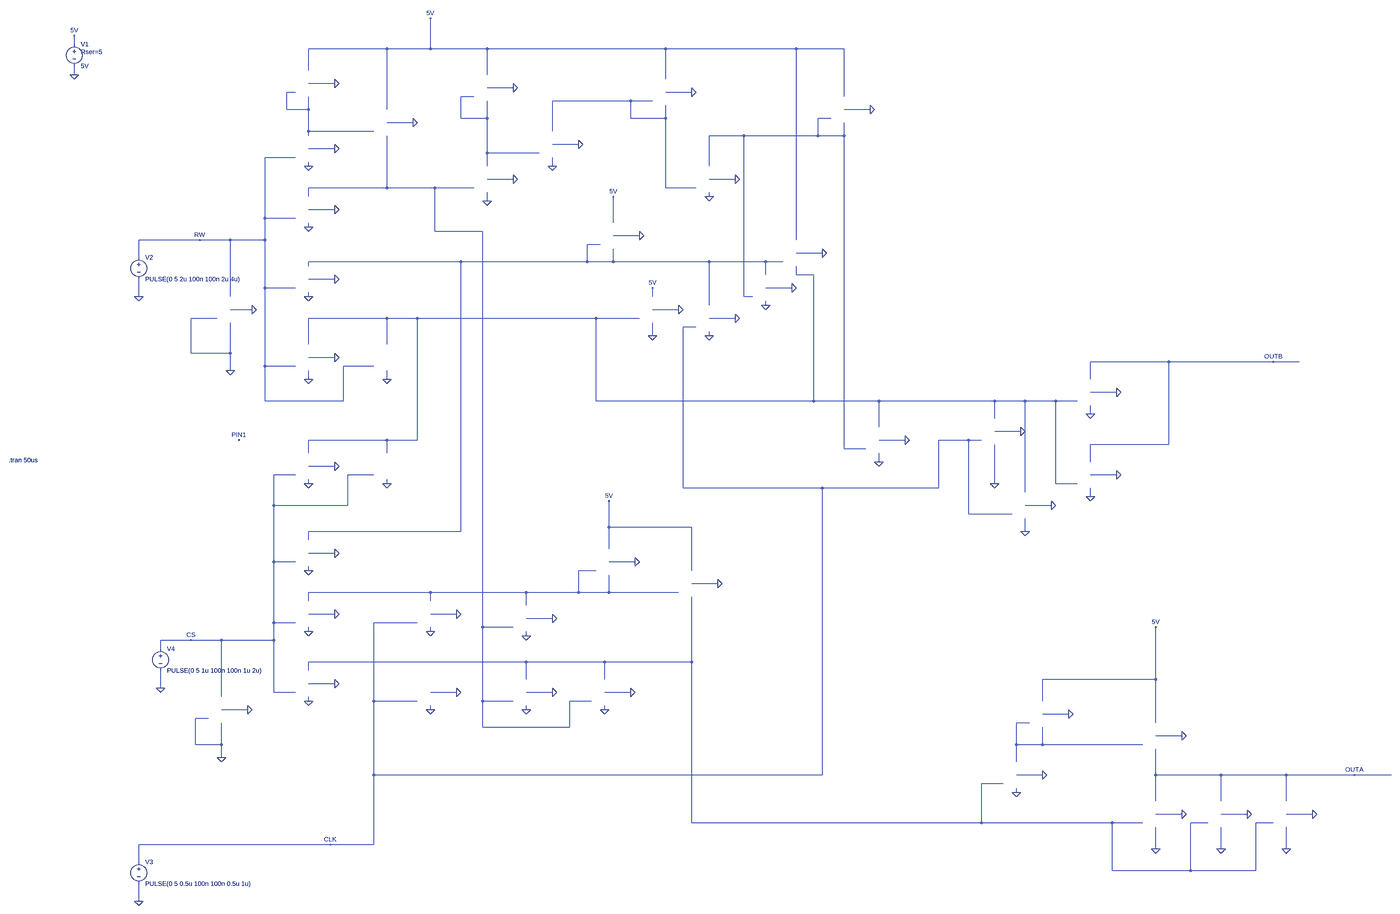
[diagram p0: schematic CSRW.asc, whole sheet]
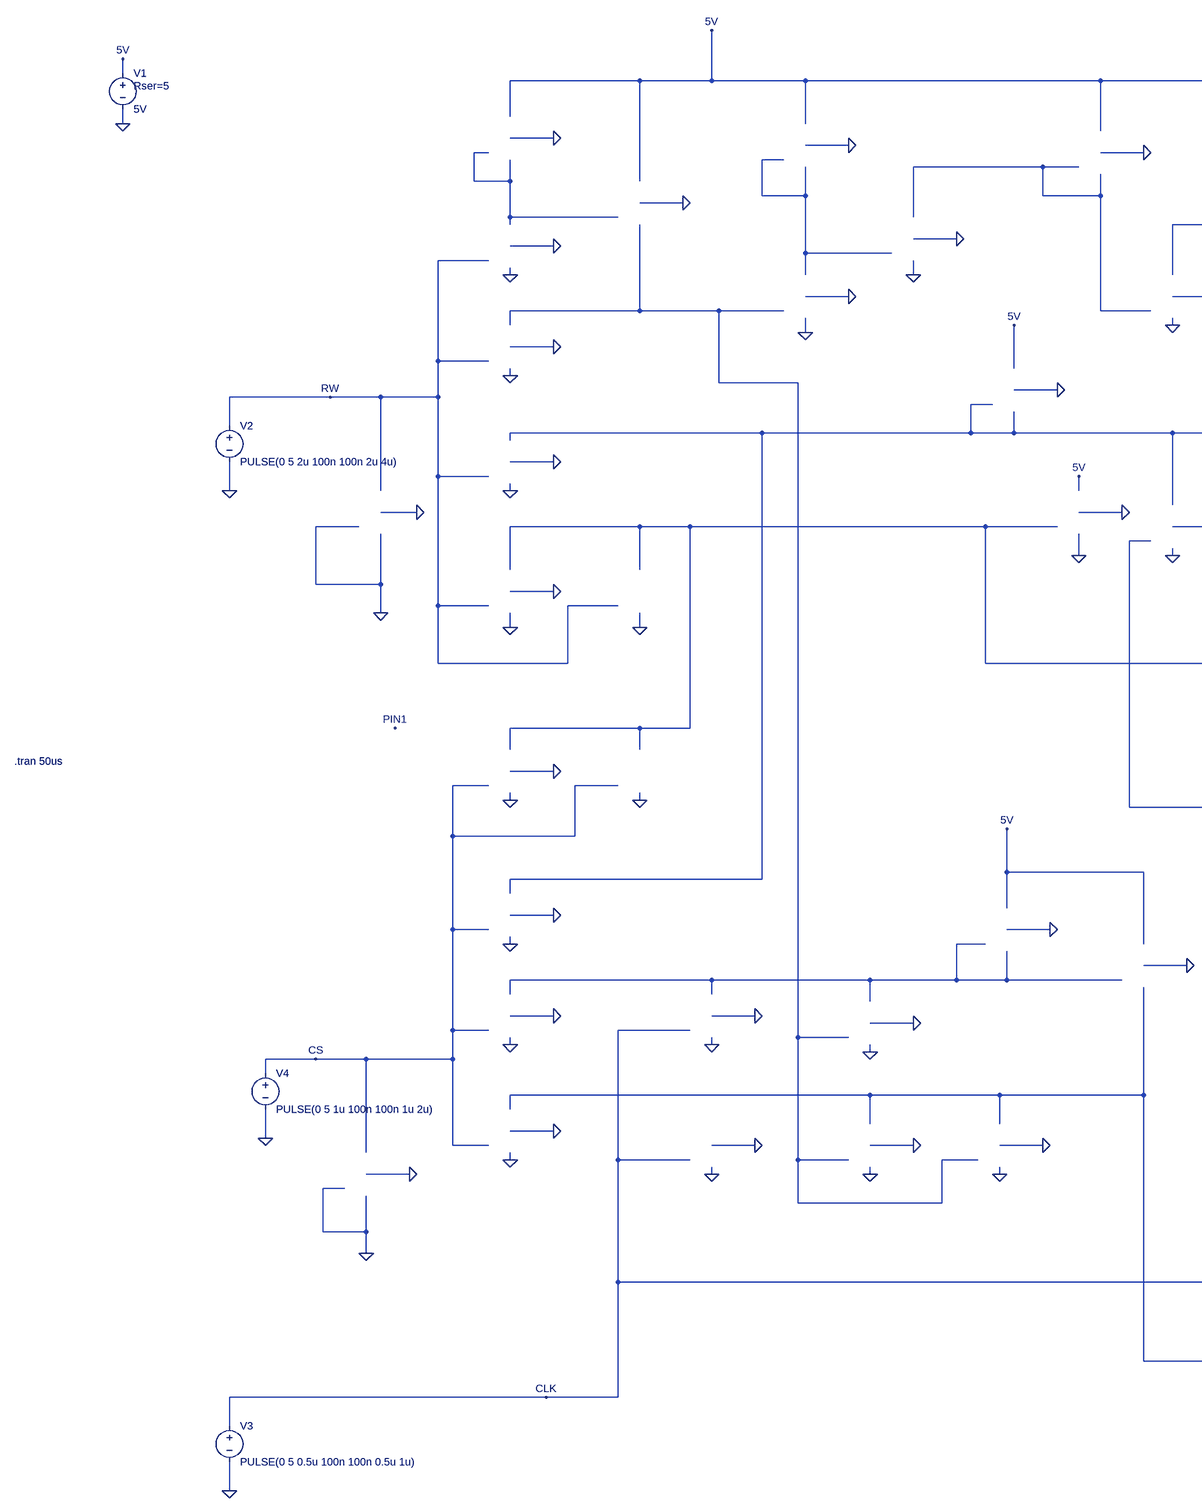
[diagram p1: schematic CSRW.asc, part, row 1 of 1, column 1 of 2]
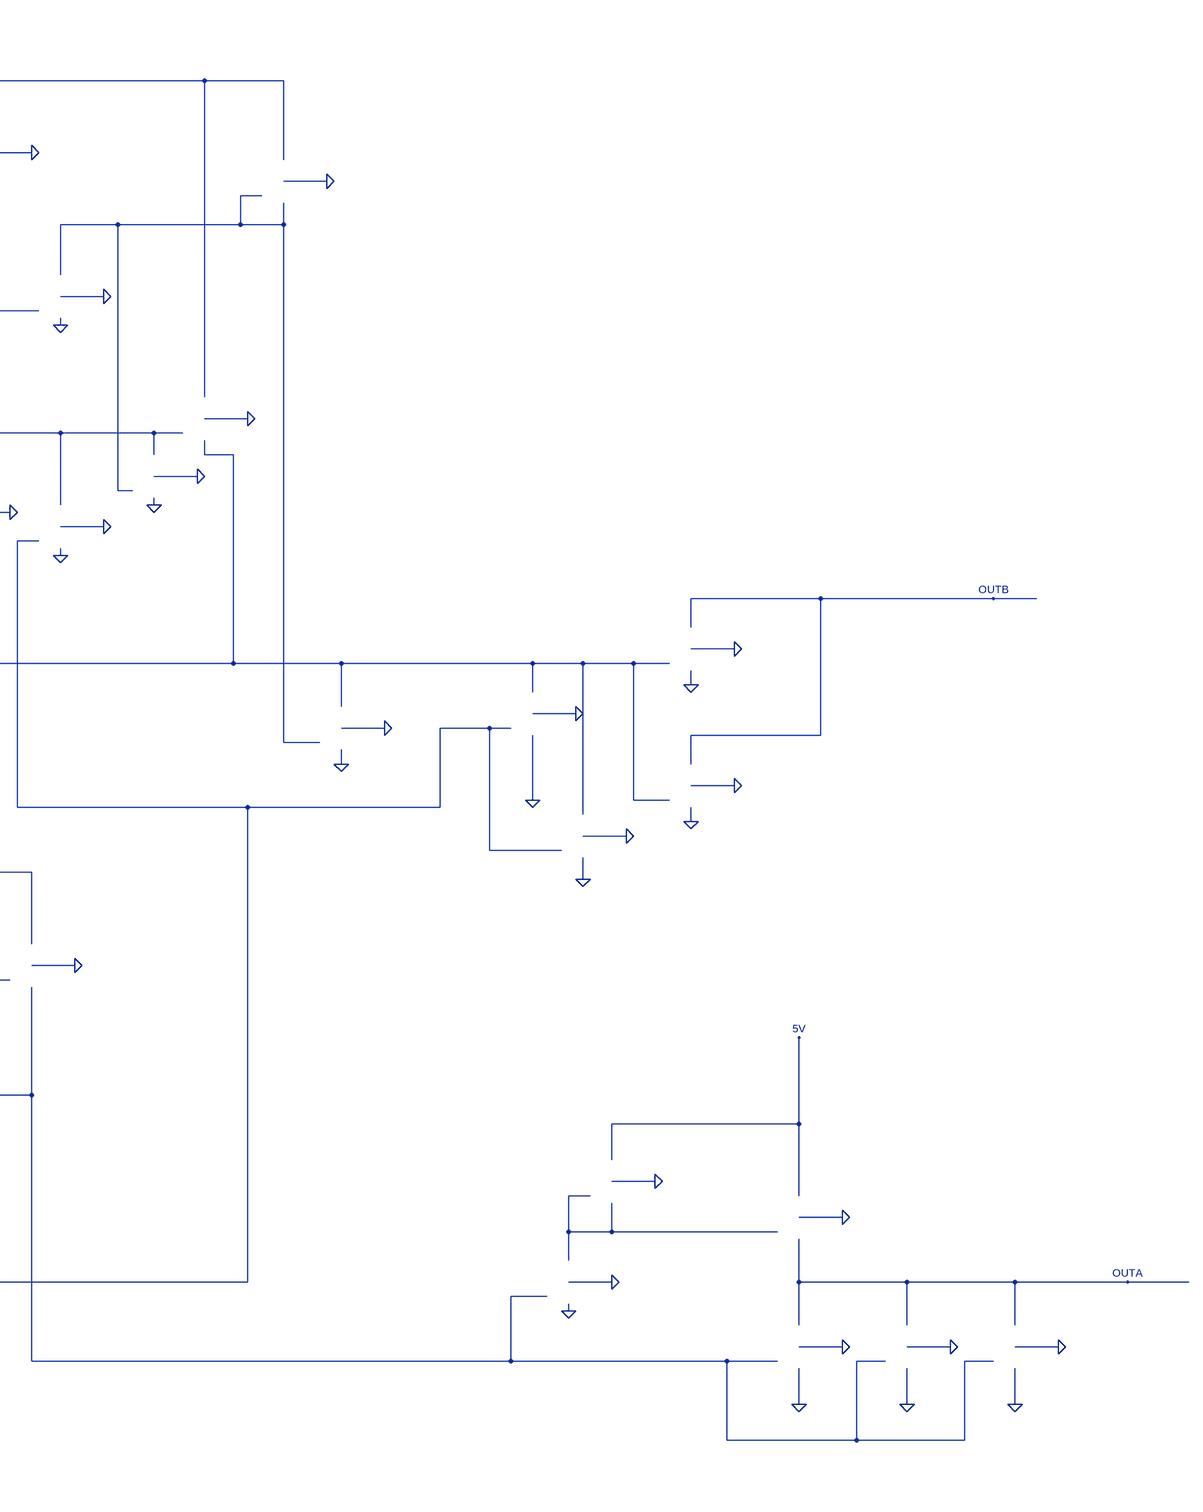
[diagram p2: schematic CSRW.asc, part, row 1 of 1, column 2 of 2]
CSRW.asc, the LTspice schematic file:
Version 4
SHEET 1 5728 2744
WIRE -3232 -1168 -3232 -1200
WIRE -2048 -1152 -2336 -1152
WIRE -1888 -1152 -1888 -1264
WIRE -1888 -1152 -2048 -1152
WIRE -1680 -1152 -1888 -1152
WIRE -1024 -1152 -1680 -1152
WIRE -544 -1152 -1024 -1152
WIRE -368 -1152 -544 -1152
WIRE -2336 -1072 -2336 -1152
WIRE -3232 -1056 -3232 -1088
WIRE -1680 -1056 -1680 -1152
WIRE -1024 -1040 -1024 -1152
WIRE -2240 -1024 -2336 -1024
WIRE -1584 -1008 -1680 -1008
WIRE -2384 -992 -2416 -992
WIRE -928 -992 -1024 -992
WIRE -1728 -976 -1776 -976
WIRE -368 -976 -368 -1152
WIRE -1152 -960 -1440 -960
WIRE -1072 -960 -1152 -960
WIRE -2416 -928 -2416 -992
WIRE -2336 -928 -2336 -976
WIRE -2336 -928 -2416 -928
WIRE -2048 -928 -2048 -1152
WIRE -272 -928 -368 -928
WIRE -1776 -896 -1776 -976
WIRE -1680 -896 -1680 -960
WIRE -1680 -896 -1776 -896
WIRE -1152 -896 -1152 -960
WIRE -1024 -896 -1024 -944
WIRE -1024 -896 -1152 -896
WIRE -416 -896 -464 -896
WIRE -1952 -880 -2048 -880
WIRE -2336 -848 -2336 -928
WIRE -2096 -848 -2336 -848
WIRE -1440 -848 -1440 -960
WIRE -2336 -832 -2336 -848
WIRE -736 -832 -864 -832
WIRE -464 -832 -464 -896
WIRE -464 -832 -736 -832
WIRE -368 -832 -368 -880
WIRE -368 -832 -464 -832
WIRE -1344 -800 -1440 -800
WIRE -2240 -784 -2336 -784
WIRE -1680 -768 -1680 -896
WIRE -1488 -768 -1680 -768
WIRE -2384 -752 -2496 -752
WIRE -2336 -720 -2336 -736
WIRE -1680 -720 -1680 -768
WIRE -1440 -720 -1440 -752
WIRE -864 -720 -864 -832
WIRE -1584 -672 -1680 -672
WIRE -768 -672 -864 -672
WIRE -2048 -640 -2048 -832
WIRE -2048 -640 -2336 -640
WIRE -1872 -640 -2048 -640
WIRE -1728 -640 -1872 -640
WIRE -1024 -640 -1024 -896
WIRE -912 -640 -1024 -640
WIRE -2336 -608 -2336 -640
WIRE -864 -608 -864 -624
WIRE -1680 -592 -1680 -624
WIRE -2240 -560 -2336 -560
WIRE -2496 -528 -2496 -752
WIRE -2384 -528 -2496 -528
WIRE -1216 -512 -1216 -608
WIRE -2336 -496 -2336 -512
WIRE -1872 -480 -1872 -640
WIRE -1696 -480 -1872 -480
WIRE -1120 -464 -1216 -464
WIRE -2736 -448 -2960 -448
WIRE -2624 -448 -2736 -448
WIRE -2496 -448 -2496 -528
WIRE -2496 -448 -2624 -448
WIRE -544 -448 -544 -1152
WIRE -1264 -432 -1312 -432
WIRE -448 -400 -544 -400
WIRE -2960 -384 -2960 -448
WIRE -1776 -368 -2336 -368
WIRE -1312 -368 -1312 -432
WIRE -1312 -368 -1776 -368
WIRE -1216 -368 -1216 -416
WIRE -1216 -368 -1312 -368
WIRE -864 -368 -1216 -368
WIRE -656 -368 -864 -368
WIRE -592 -368 -656 -368
WIRE -2336 -352 -2336 -368
WIRE -656 -320 -656 -368
WIRE -544 -320 -544 -352
WIRE -480 -320 -544 -320
WIRE -2240 -304 -2336 -304
WIRE -2496 -272 -2496 -448
WIRE -2384 -272 -2496 -272
WIRE -560 -272 -656 -272
WIRE -2960 -240 -2960 -304
WIRE -2624 -240 -2624 -448
WIRE -2336 -240 -2336 -256
WIRE -1072 -240 -1072 -272
WIRE -736 -240 -736 -832
WIRE -704 -240 -736 -240
WIRE -864 -208 -864 -368
WIRE -656 -208 -656 -224
WIRE -2544 -192 -2624 -192
WIRE -976 -192 -1072 -192
WIRE -2672 -160 -2768 -160
WIRE -2048 -160 -2336 -160
WIRE -1936 -160 -2048 -160
WIRE -1280 -160 -1936 -160
WIRE -1120 -160 -1280 -160
WIRE -768 -160 -864 -160
WIRE -912 -128 -960 -128
WIRE -1072 -96 -1072 -144
WIRE -864 -96 -864 -112
WIRE -2336 -64 -2336 -160
WIRE -2048 -64 -2048 -160
WIRE -2768 -32 -2768 -160
WIRE -2624 -32 -2624 -144
WIRE -2624 -32 -2768 -32
WIRE -2240 -16 -2336 -16
WIRE 912 0 624 0
WIRE 1296 0 912 0
WIRE 1392 0 1296 0
WIRE -2496 16 -2496 -272
WIRE -2384 16 -2496 16
WIRE -2096 16 -2208 16
WIRE -2624 32 -2624 -32
WIRE -2336 64 -2336 32
WIRE -2048 64 -2048 32
WIRE 624 64 624 0
WIRE 720 112 624 112
WIRE -2496 144 -2496 16
WIRE -2208 144 -2208 16
WIRE -2208 144 -2496 144
WIRE -1280 144 -1280 -160
WIRE -480 144 -480 -320
WIRE -480 144 -1280 144
WIRE -240 144 -480 144
WIRE 272 144 -240 144
WIRE 384 144 272 144
WIRE 496 144 384 144
WIRE 576 144 496 144
WIRE 624 192 624 160
WIRE 272 208 272 144
WIRE -240 240 -240 144
WIRE 368 256 272 256
WIRE -2048 288 -2336 288
WIRE -1936 288 -1936 -160
WIRE -1936 288 -2048 288
WIRE -144 288 -240 288
WIRE 176 288 16 288
WIRE 224 288 176 288
WIRE 912 304 912 0
WIRE 912 304 624 304
WIRE -368 320 -368 -832
WIRE -288 320 -368 320
WIRE -2336 336 -2336 288
WIRE -2048 336 -2048 288
WIRE -240 368 -240 336
WIRE 624 368 624 304
WIRE -2240 384 -2336 384
WIRE -2384 416 -2464 416
WIRE -2096 416 -2192 416
WIRE 720 416 624 416
WIRE -2336 448 -2336 432
WIRE -2048 448 -2048 432
WIRE 272 448 272 304
WIRE 496 448 496 144
WIRE 576 448 496 448
WIRE -960 464 -960 -128
WIRE -448 464 -960 464
WIRE 16 464 16 288
WIRE 16 464 -448 464
WIRE 384 480 384 144
WIRE 624 496 624 464
WIRE -2464 528 -2464 416
WIRE -2192 528 -2192 416
WIRE -2192 528 -2464 528
WIRE 480 528 384 528
WIRE 176 560 176 288
WIRE 336 560 176 560
WIRE -1232 608 -1232 512
WIRE -928 608 -1232 608
WIRE -1776 624 -1776 -368
WIRE -1776 624 -2336 624
WIRE 384 624 384 576
WIRE -2336 656 -2336 624
WIRE -1232 688 -1232 608
WIRE -2240 704 -2336 704
WIRE -2464 736 -2464 528
WIRE -2384 736 -2464 736
WIRE -1136 736 -1232 736
WIRE -2336 768 -2336 752
WIRE -1280 768 -1344 768
WIRE -928 768 -928 608
WIRE -832 816 -928 816
WIRE -1888 848 -2336 848
WIRE -1536 848 -1888 848
WIRE -1344 848 -1344 768
WIRE -1344 848 -1536 848
WIRE -1232 848 -1232 784
WIRE -1232 848 -1344 848
WIRE -976 848 -1232 848
WIRE -2336 880 -2336 848
WIRE -1888 880 -1888 848
WIRE -1536 896 -1536 848
WIRE -2240 928 -2336 928
WIRE -1792 928 -1888 928
WIRE -1440 944 -1536 944
WIRE -2464 960 -2464 736
WIRE -2384 960 -2464 960
WIRE -1936 960 -2096 960
WIRE -1696 976 -1696 -480
WIRE -1584 976 -1696 976
WIRE -2336 992 -2336 976
WIRE -1888 992 -1888 976
WIRE -1536 1008 -1536 992
WIRE -2768 1024 -2880 1024
WIRE -2656 1024 -2768 1024
WIRE -2464 1024 -2464 960
WIRE -2464 1024 -2656 1024
WIRE -2880 1056 -2880 1024
WIRE -1536 1104 -2336 1104
WIRE -1248 1104 -1536 1104
WIRE -928 1104 -928 864
WIRE -928 1104 -1248 1104
WIRE -2336 1136 -2336 1104
WIRE -1536 1168 -1536 1104
WIRE -1248 1168 -1248 1104
WIRE 864 1168 864 976
WIRE 864 1168 448 1168
WIRE -2240 1184 -2336 1184
WIRE -2880 1200 -2880 1136
WIRE -2464 1216 -2464 1024
WIRE -2384 1216 -2464 1216
WIRE -1792 1216 -1888 1216
WIRE -1440 1216 -1536 1216
WIRE -1152 1216 -1248 1216
WIRE -2656 1232 -2656 1024
WIRE -2336 1248 -2336 1232
WIRE -2096 1248 -2096 960
WIRE -1936 1248 -2096 1248
WIRE -1696 1248 -1696 976
WIRE -1584 1248 -1696 1248
WIRE -1296 1248 -1376 1248
WIRE 448 1248 448 1168
WIRE -2560 1280 -2656 1280
WIRE -1888 1280 -1888 1264
WIRE -1536 1280 -1536 1264
WIRE -1248 1280 -1248 1264
WIRE 544 1296 448 1296
WIRE -2704 1312 -2752 1312
WIRE 400 1328 352 1328
WIRE 864 1328 864 1168
WIRE -1696 1344 -1696 1248
WIRE -1376 1344 -1376 1248
WIRE -1376 1344 -1696 1344
WIRE 960 1376 864 1376
WIRE -2752 1408 -2752 1312
WIRE -2656 1408 -2656 1328
WIRE -2656 1408 -2752 1408
WIRE 352 1408 352 1328
WIRE 448 1408 448 1344
WIRE 448 1408 352 1408
WIRE 816 1408 448 1408
WIRE -2656 1456 -2656 1408
WIRE 352 1472 352 1408
WIRE -2096 1520 -2096 1248
WIRE -448 1520 -448 464
WIRE -448 1520 -2096 1520
WIRE 448 1520 352 1520
WIRE 864 1520 864 1424
WIRE 1104 1520 864 1520
WIRE 1344 1520 1104 1520
WIRE 1664 1520 1344 1520
WIRE 1840 1520 1664 1520
WIRE 304 1552 224 1552
WIRE 352 1584 352 1568
WIRE 864 1616 864 1520
WIRE 1104 1616 1104 1520
WIRE 1344 1616 1344 1520
WIRE 960 1664 864 1664
WIRE 1200 1664 1104 1664
WIRE 1440 1664 1344 1664
WIRE -928 1696 -928 1104
WIRE 224 1696 224 1552
WIRE 224 1696 -928 1696
WIRE 704 1696 224 1696
WIRE 816 1696 704 1696
WIRE 1056 1696 992 1696
WIRE 1296 1696 1232 1696
WIRE -2256 1776 -2960 1776
WIRE -2096 1776 -2096 1520
WIRE -2096 1776 -2256 1776
WIRE 864 1792 864 1712
WIRE 1104 1792 1104 1712
WIRE 1344 1792 1344 1712
WIRE -2960 1840 -2960 1776
WIRE 704 1872 704 1696
WIRE 992 1872 992 1696
WIRE 992 1872 704 1872
WIRE 1232 1872 1232 1696
WIRE 1232 1872 992 1872
WIRE -2960 1984 -2960 1920
FLAG -2624 32 0
FLAG -2736 -448 RW
FLAG -2336 64 0
FLAG -2048 64 0
FLAG -2336 -240 0
FLAG -2336 -720 0
FLAG -2336 -496 0
FLAG -2768 1024 CS
FLAG -2656 1456 0
FLAG -2336 448 0
FLAG -2048 448 0
FLAG -2336 768 0
FLAG -1888 -1264 5V
FLAG -3232 -1056 0
FLAG -3232 -1200 5V
FLAG -1680 -592 0
FLAG -1536 1280 0
FLAG -1248 1280 0
FLAG -1536 1008 0
FLAG -1440 -720 0
FLAG -864 -608 0
FLAG -1072 -96 0
FLAG -1072 -272 5V
FLAG 1296 0 OUTB
FLAG 624 192 0
FLAG 624 496 0
FLAG 272 448 0
FLAG 384 624 0
FLAG -240 368 0
FLAG 864 976 5V
FLAG 1664 1520 OUTA
FLAG 864 1792 0
FLAG 1104 1792 0
FLAG 1344 1792 0
FLAG 352 1584 0
FLAG -1232 512 5V
FLAG -2336 992 0
FLAG -2336 1248 0
FLAG -1888 992 0
FLAG -1888 1280 0
FLAG -864 -96 0
FLAG -656 -208 0
FLAG -1216 -608 5V
FLAG -2240 -784 0
FLAG -2240 -1024 0
FLAG -2544 -192 0
FLAG -2240 384 0
FLAG -2240 -16 0
FLAG -2240 -304 0
FLAG -2240 -560 0
FLAG -2960 -240 0
FLAG -2960 1984 0
FLAG -2256 1776 CLK
FLAG -2880 1200 0
FLAG -2240 704 0
FLAG -2240 928 0
FLAG -2240 1184 0
FLAG -1792 1216 0
FLAG -1792 928 0
FLAG -1440 944 0
FLAG -1440 1216 0
FLAG -1152 1216 0
FLAG -1136 736 0
FLAG -832 816 0
FLAG 448 1520 0
FLAG 544 1296 0
FLAG 960 1376 0
FLAG 960 1664 0
FLAG 1200 1664 0
FLAG 1440 1664 0
FLAG -2560 1280 0
FLAG -1952 -880 0
FLAG -1584 -1008 0
FLAG -1584 -672 0
FLAG -1344 -800 0
FLAG -928 -992 0
FLAG -768 -672 0
FLAG -272 -928 0
FLAG -560 -272 0
FLAG -448 -400 0
FLAG -768 -160 0
FLAG -976 -192 0
FLAG -1120 -464 0
FLAG -144 288 0
FLAG 368 256 0
FLAG 480 528 0
FLAG 720 416 0
FLAG 720 112 0
FLAG -2592 288 PIN1
SYMBOL voltage -3232 -1184 R0
WINDOW 123 0 0 Left 0
WINDOW 39 24 44 Left 2
SYMATTR InstName V1
SYMATTR Value 5V
SYMATTR SpiceLine Rser=5
SYMBOL voltage -2960 -400 R0
WINDOW 123 0 0 Left 0
WINDOW 39 0 0 Left 0
SYMATTR InstName V2
SYMATTR Value PULSE(0 5 2u 100n 100n 2u 4u)
SYMBOL voltage -2960 1824 R0
SYMATTR InstName V3
SYMATTR Value PULSE(0 5 0.5u 100n 100n 0.5u 1u)
SYMBOL voltage -2880 1040 R0
SYMATTR InstName V4
SYMATTR Value PULSE(0 5 1u 100n 100n 1u 2u)
TEXT -3698 362 Left 2 !.tran 50us

The netlist it stands for:
* CSRW.asc
V1 5V 0 5V Rser=5
V2 RW 0 PULSE(0 5 2u 100n 100n 2u 4u)
V3 CLK 0 PULSE(0 5 0.5u 100n 100n 0.5u 1u)
V4 CS 0 PULSE(0 5 1u 100n 100n 1u 2u)
.tran 50us
.backanno
.end